# Altium schematic sheet Bridge.SchDoc
size A4
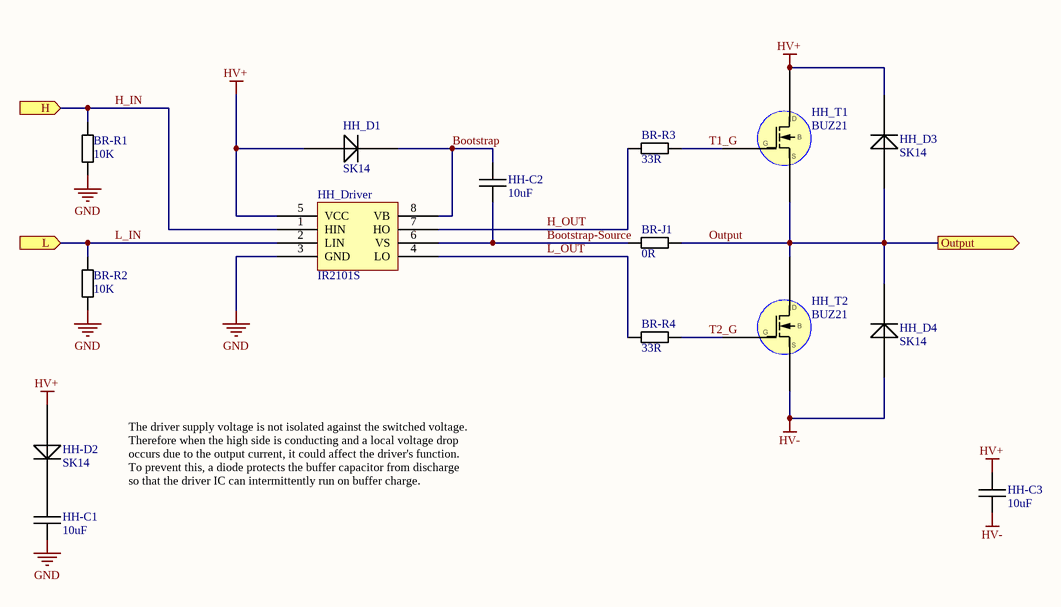
[diagram p0: Bridge.SchDoc]

## Parts
BR-J1  0R  [R 0805 / 2012 wide]
BR-R1  10K  [R 0805 / 2012]
BR-R2  10K  [R 0805 / 2012]
BR-R3  33R  [R 0805 / 2012]
BR-R4  33R  [R 0805 / 2012]
HH-C1  10uF  [C 0805 / 2012]
HH-C2  10uF  [C 0805 / 2012]
HH-C3  10uF  [Header 1x2+1 1.0mm]
HH-D2  SK14  [SC-90]
HH_D1  SK14  [SC-90]
HH_D3  SK14  [SC-90]
HH_D4  SK14  [SC-90]
HH_Driver  IR2101S  [SOIC-8]
HH_T1  BUZ21  [TO-220 AB]
HH_T2  BUZ21  [TO-220 AB]

## Ports
H (in), L (in), Output (out)

## Nets
GND: BR-R1.1 BR-R2.1 HH-C1.2 HH_Driver.3(GND)
HV+: HH-C3.1 HH-D2.2 HH_D1.2 HH_D3.1 HH_Driver.5(VCC) HH_T1.2
HV-: HH-C3.2 HH_D4.2 HH_T2.3
Bootstrap: HH-C2.1 HH_D1.1 HH_Driver.8(VB)
Bootstrap-Source: BR-J1.1 HH-C2.2 HH_Driver.6(VS)
H_IN: BR-R1.2 HH_Driver.1(HIN) ; port H
H_OUT: BR-R3.1 HH_Driver.7(HO)
L_IN: BR-R2.2 HH_Driver.2(LIN) ; port L
L_OUT: BR-R4.1 HH_Driver.4(LO)
Output: BR-J1.2 HH_D3.2 HH_D4.1 HH_T1.3 HH_T2.2 ; port Output
T1_G: BR-R3.2 HH_T1.1
T2_G: BR-R4.2 HH_T2.1
NetHH-C1_1: HH-C1.1 HH-D2.1

## Notes on the sheet
- The driver supply voltage is not isolated against the switched voltage.
  Therefore when the high side is conducting and a local voltage drop
  occurs due to the output current, it could affect the driver's function.
  To prevent this, a diode protects the buffer capacitor from discharge
  so that the driver IC can intermittently run on buffer charge.

## Library data of the parts
BR-J1 BR-R1-BR-R4 = Resistor
HH-C1-HH-C3 = Capacitor
HH-D2 HH_D1 HH_D3 HH_D4 = Diode
HH_Driver = IR21xx: High and Low Side Driver; Website: http://www.irf.com/part/High-and-Low-Side-Driver-Noninverting-Inputs/_/A~IR2101
HH_T1 HH_T2 = FET N-Channel: Enhancement Type